# EAGLE design infrared_receiver_controller (EAGLE 9.6.2)
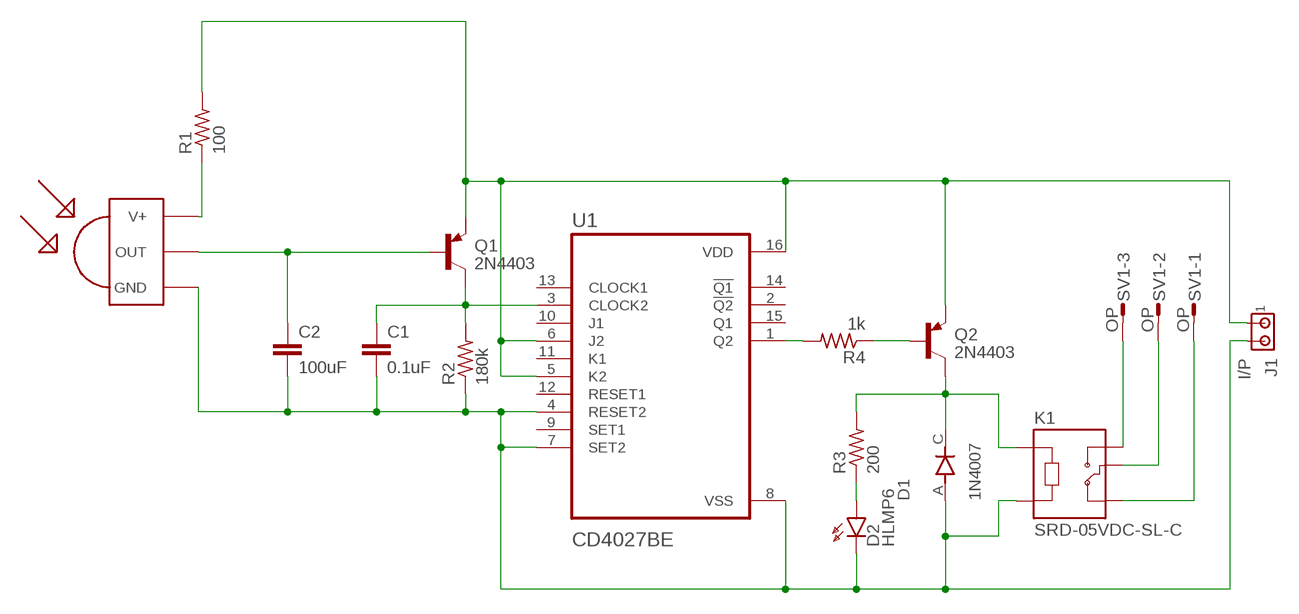
[diagram p0: schematic, sheet 1]

## Parts
C1  0.1uF  C2.5/2  [C2.5-2]
C2  100uF  C2.5/2  [C2.5-2]
D1  1N4007  [DIOAD1060W80L520D270]
D2  HLMP6  [HLMP6]
J1  I/P  MTA02-100  [10X02MTA]
K1  SRD-05VDC-SL-C  [RELAY_SRD-05VDC-SL-C]
Q1  2N4403  [TO92]
Q2  2N4403  [TO92]
R1  100  R-US_0204/7  [0204/7]
R2  180k  R-US_0204/7  [0204/7]
R3  200  R-US_0204/7  [0204/7]
R4  1k  R-US_0204/7  [0204/7]
SV1  OP  L03P  [L03P]
U1  CD4027BE  [DIP794W45P254L1969H508Q16]
U$1  TSOP1738  [TSOP17XX]

## Nets
N$1: Q2.2(B) R4.1
N$2: R1.1 U$1.V+
N$3: D2.A R3.1
N$4: J1.1 Q1.1(E) Q2.1(E) R1.2 U1.5(K2) U1.6(J2) U1.16(VDD)
N$5: C2.1 Q1.2(B) U$1.OUT
N$6: C1.1 Q1.3(C) R2.2 U1.3(CLOCK2)
N$7: C1.2 C2.2 D1.A D2.K J1.2 K1.A2 R2.1 U1.4(RESET2) U1.7(SET2) U1.8(VSS) U$1.GND
N$8: R4.2 U1.1(Q2)
N$9: D1.C K1.A1 Q2.3(C) R3.2
N$10: K1.NO SV1.3
N$11: K1.COM SV1.2
N$12: K1.NC SV1.1
Unconnected: U1.2(!Q2) U1.9(SET1) U1.10(J1) U1.11(K1) U1.12(RESET1) U1.13(CLOCK1) U1.14(!Q1) U1.15(Q1)

## Library data of the parts
C1 C2 = capacitor-wima:C: CAPACITOR naming: grid - package width
D1 = 1N4007:1N4007: Check availability <https://pricing.snapeda.com/parts/1N4007/Diotec%20Semiconductor/view-part?ref=eda>; AVAILABILITY: In Stock; CHECK_PRICES: https://www.snapeda.com/parts/1N4007/Diotec/view-part/?ref=eda; DESCRIPTION: Diode, DO-41, 1000V, 1A, 175°C; MF: Diotec Semiconductor; MP: 1N4007; PACKAGE: DO-41 Diotec; PRICE: None; PURCHASE-URL: https://www.snapeda.com/api/url_track_click_mouser/?unipart_id=4794800&manufacturer=Diotec Semiconductor&part_name=1N4007&search_term=1n4007; SNAPEDA_LINK: https://www.snapeda.com/parts/1N4007/Diotec/view-part/?ref=snap
D2 = display-hp:HLMP6: LED 2mm horizontal; MF: AGILENT TECHNOLOGIES; MPN: HLMP-6500; OC_FARNELL: 1652490; OC_NEWARK: 40K0088
J1 = con-amp:MTA02-100: AMP connector
K1 = SRD-05VDC-SL-C:SRD-05VDC-SL-C: Check availability <https://pricing.snapeda.com/parts/SRD-05VDC-SL-C/Songle%20Relay/view-part?ref=eda>; AVAILABILITY: In Stock; CHECK_PRICES: https://www.snapeda.com/parts/SRD-05VDC-SL-C/Songle+Relay/view-part/?ref=eda; DESCRIPTION: 5V Trigger Relay Module For Arduino And Raspberry Pi 5V Trigger Relay Module For Arduino And Raspberry Pi; MF: Songle Relay; MP: SRD-05VDC-SL-C; PACKAGE: NON STANDARD-5 Songle Relay; PRICE: None; SNAPEDA_LINK: https://www.snapeda.com/parts/SRD-05VDC-SL-C/Songle+Relay/view-part/?ref=snap
Q1 Q2 = 2N4403:2N4403: Check availability <https://pricing.snapeda.com/parts/2N4403/Central%20Semiconductor/view-part?ref=eda>; AVAILABILITY: In Stock; CHECK_PRICES: https://www.snapeda.com/parts/2N4403/Central+Components+Manufacturing/view-part/?ref=eda; DESCRIPTION: Bipolar (BJT) Transistor PNP 40 V 600 mA 200MHz 625 mW Through Hole TO-92-3; MF: Central Semiconductor; MP: 2N4403; PACKAGE: TO-92 Central Semiconductor; PRICE: None; SNAPEDA_LINK: https://www.snapeda.com/parts/2N4403/Central+Components+Manufacturing/view-part/?ref=snap
R1-R4 = rcl:R-US_: RESISTOR, American symbol; SPICEPREFIX: R
SV1 = con-amp-mt:L03P: AMP MT CONNECTOR; OC_FARNELL: unknown; OC_NEWARK: unknown
U1 = CD4027BE:CD4027BE: Check availability <https://pricing.snapeda.com/parts/CD4027BE/Texas%20Instruments/view-part?ref=eda>; AVAILABILITY: In Stock; CHECK_PRICES: https://www.snapeda.com/parts/CD4027BE/Texas+Instruments/view-part/?ref=eda; DESCRIPTION: CMOS Dual J-K Master-Slave Flip-Flop; MF: Texas Instruments; MP: CD4027BE; PACKAGE: PDIP-16 Texas Instruments; PRICE: None; PURCHASE-URL: https://www.snapeda.com/api/url_track_click_mouser/?unipart_id=129216&manufacturer=Texas Instruments&part_name=CD4027BE&search_term=None; SNAPEDA_LINK: https://www.snapeda.com/parts/CD4027BE/Texas+Instruments/view-part/?ref=snap
U$1 = TSOP1738:TSOP1738: Check availability <https://pricing.snapeda.com/parts/TSOP1738./Vishay/view-part?ref=eda>; AVAILABILITY: In Stock; CHECK_PRICES: https://www.snapeda.com/parts/TSOP1738./Vishay/view-part/?ref=eda; DESCRIPTION: IR Remote Receiver 38KHz 35m 3-Pin; MF: Vishay; MP: TSOP1738.; PACKAGE: DIP-3 Vishay; PRICE: None; PURCHASE-URL: https://www.snapeda.com/api/url_track_click_mouser/?unipart_id=420043&manufacturer=Vishay&part_name=TSOP1738.&search_term=tsop 1738; SNAPEDA_LINK: https://www.snapeda.com/parts/TSOP1738./Vishay/view-part/?ref=snap

## Net classes
0 default: clearance 0.205 mm

## Board
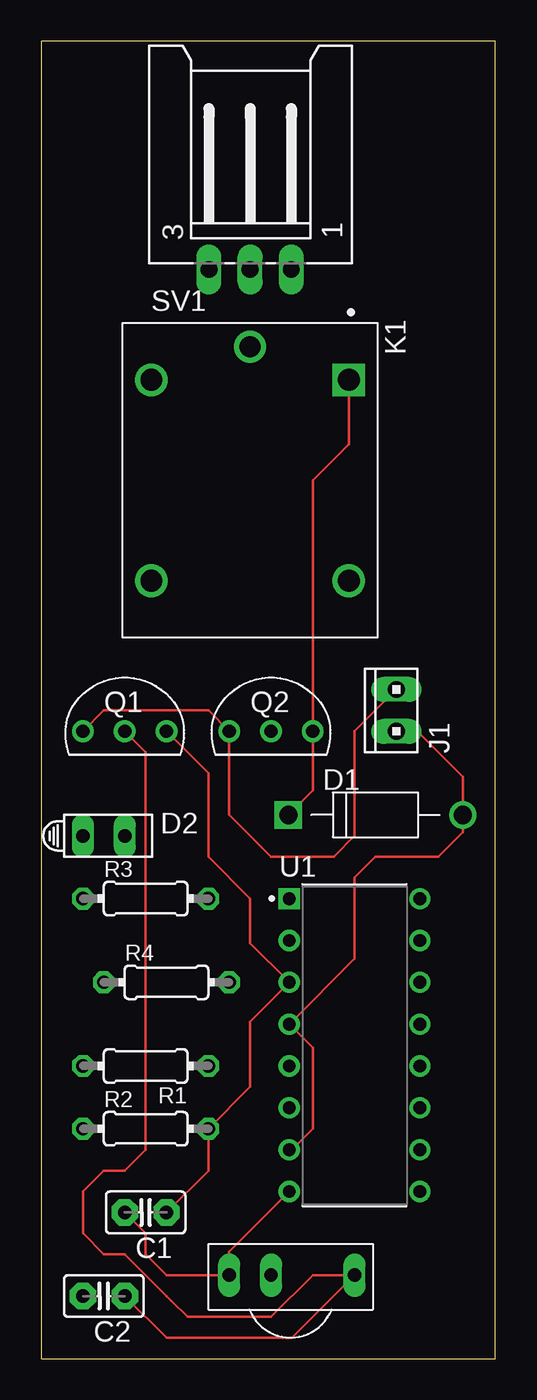
[diagram p1: board, top side]
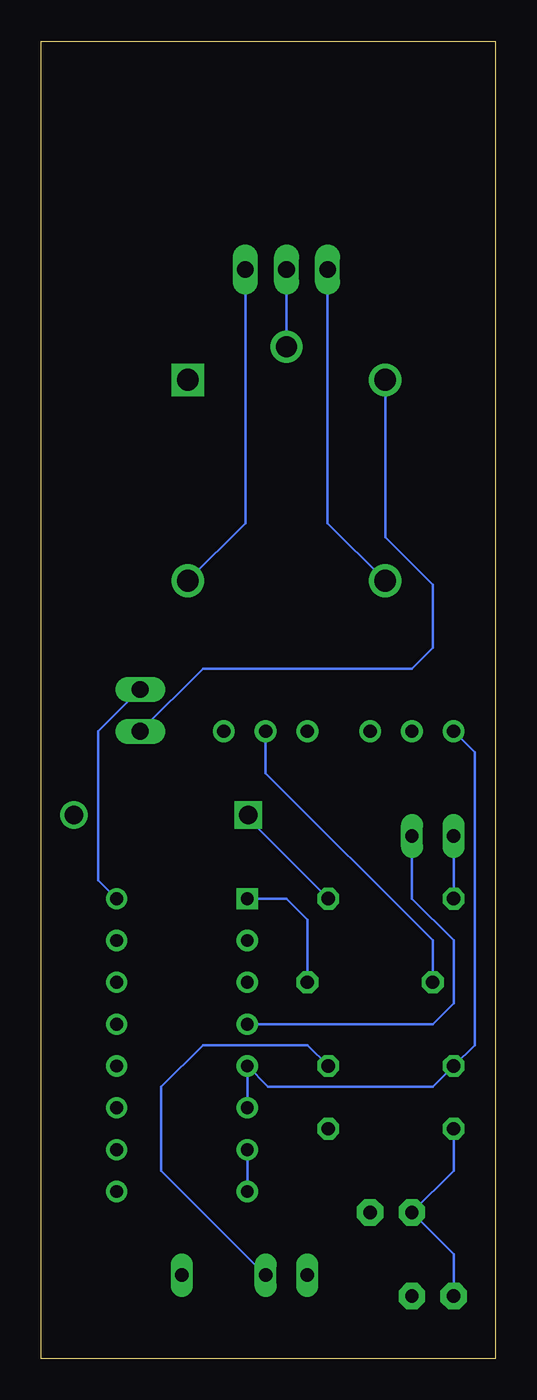
[diagram p2: board, bottom side, seen from below]

Size 27.61 x 80 mm. Coordinates in mm from the lower left corner, seen from the top.
Outline: 0,0 27.61,0 27.61,80 0,80 0,0
Copper layers (1*16): Top 0.035mm / dielectric 1.5mm / Bottom 0.035mm
Design rules "default": minimum track width 6mil, minimum drill 0.35mm, track to track 6mil, track to pad 6mil, pad to pad 6mil, via to via 6mil, smd to smd 6mil, copper to edge 40mil, drill to drill 6mil, minimum pad ring 10mil, minimum via ring 8mil, stop-mask expansion 4mil, vias tented up to drill 0mil, thermal gap 10mil

### Footprints (pad centres in the part's own frame; a part is rotated, then mirrored left to right if it is on the bottom)
C2.5-2 = drill 0.813 pad 1.6 octagon: 1 -1.27,0; 2 1.27,0
DIOAD1060W80L520D270 = drill 1.1 pad 1.65: A 5.3,0 | drill 1.1 pad 1.65 square: C -5.3,0
HLMP6 = drill 0.813 long: A -1.27,0; K 1.27,0
10X02MTA = drill 1.016 long: 1 1.27,0; 2 -1.27,0
RELAY_SRD-05VDC-SL-C = drill 1.32 square: A1 -6.1,6 | drill 1.32: A2 -6.1,-6; NC 6.1,6; NO 6.1,-6 | drill 1.29: COM -8.1,0
TO92 = drill 0.813: 1 -2.54,0; 2 0,0; 3 2.54,0
0204/7 = drill 0.813 octagon: 1 -3.81,0; 2 3.81,0
L03P = drill 1.016 long: 1 2.5,-6.25; 2 0,-6.25; 3 -2.5,-6.25
DIP794W45P254L1969H508Q16 = drill 0.78 pad 1.13 square: 1 -3.97,8.89 | drill 0.78 pad 1.13: 2 -3.97,6.35; 3 -3.97,3.81; 4 -3.97,1.27; 5 -3.97,-1.27; 6 -3.97,-3.81; 7 -3.97,-6.35; 8 -3.97,-8.89; 9 3.97,-8.89; 10 3.97,-6.35; 11 3.97,-3.81; 12 3.97,-1.27; 13 3.97,1.27; 14 3.97,3.81; 15 3.97,6.35; 16 3.97,8.89
TSOP17XX = drill 0.813 long: GND -3.81,0; OUT 3.81,0; V+ -1.27,0

### Placement (x,y rotation side)
C1  6.35,8.89 180 top
C2  3.81,3.81 180 top
D1  20.32,33.02 0 top
D2  3.81,31.75 0 top
J1  21.59,39.37 90 top
K1  12.7,53.34 270 top
Q1  5.08,38.1 0 top
Q2  13.97,38.1 0 top
R1  6.35,17.78 180 top
R2  6.35,13.97 0 top
R3  6.35,27.94 0 top
R4  7.62,22.86 0 top
SV1  12.7,72.39 0 top
U1  19.05,19.05 0 top
U$1  15.24,5.08 0 top

### Tracks (layer width: path | path; a pad name or v marks a point on that pad's centre or on a via)
N$1
  Bottom 0.152: Q2.2 13.97,35.56 3.81,25.4 R4.1
N$2
  Bottom 0.152: R1.1 11.43,19.05 17.78,19.05 20.32,16.51 20.32,11.43 U$1.V+
N$3
  Bottom 0.152: R3.1 D2.A
N$4
  Top 0.152: J1.1 19.05,38.1 19.05,31.75 17.78,30.48 13.97,30.48 11.43,33.02 Q2.1 10.16,39.37 3.81,39.37 Q1.1
  Bottom 0.152: J1.1 24.13,38.1 24.13,29.05 U1.16 | Q1.1 1.27,36.83 1.27,19.05 R1.2 3.81,16.51 13.81,16.51 U1.5 U1.6
N$5
  Top 0.152: Q1.2 6.35,36.83 6.35,12.7 5.08,11.43 3.81,11.43 2.54,10.16 2.54,7.62 3.81,6.35 5.08,6.35 7.62,3.81 7.9,3.53 8.89,2.54 13.97,2.54 16.51,5.08 U$1.OUT 15.24,1.27 7.62,1.27 C2.1
N$6
  Top 0.152: Q1.3 10.16,35.56 10.16,30.48 12.7,27.94 12.7,25.24 U1.3 12.7,20.48 12.7,16.51 R2.2 10.16,11.43 C1.1
N$7
  Top 0.152: J1.2 22.86,38.1 25.62,35.34 D1.A 25.62,31.97 24.13,30.48 20.32,30.48 19.05,29.21 19.05,24.29 U1.4 16.51,18.89 16.51,13.97 15.24,12.7 U1.7 | C1.2 6.35,7.62 6.35,6.35 7.62,5.08 U$1.GND 11.43,6.51 U1.8
  Bottom 0.152: K1.A2 6.7,49.88 3.81,46.99 3.81,43.18 5.08,41.91 17.78,41.91 J1.2 | D2.K 5.08,27.94 2.54,25.4 2.54,21.59 3.81,20.32 U1.4 | U1.8 U1.7 | R2.1 2.54,11.43 C1.2 2.54,6.35 C2.2
N$8
  Bottom 0.152: R4.2 11.43,26.67 12.7,27.94 U1.1
N$9
  Top 0.152: K1.A1 18.7,55.53 16.51,53.34 Q2.3 16.51,34.51 D1.C
  Bottom 0.152: D1.C 15.02,32.8 R3.2
N$10
  Bottom 0.152: SV1.3 10.2,50.74 K1.NO
N$11
  Bottom 0.152: SV1.2 K1.COM
N$12
  Bottom 0.152: K1.NC 15.2,50.74 SV1.1